# Altium schematic sheet CONNECTOR_A.SchDoc: =project_title
size Tabloid; CompanyName: Luxonis Holding; Organization: Luxonis Holding; Address1: 1925 Harmony Park Drive; Address2: Westminster, CO; Address3: 80234; Address4: United States; SheetNumber: 5; SheetTotal: 14
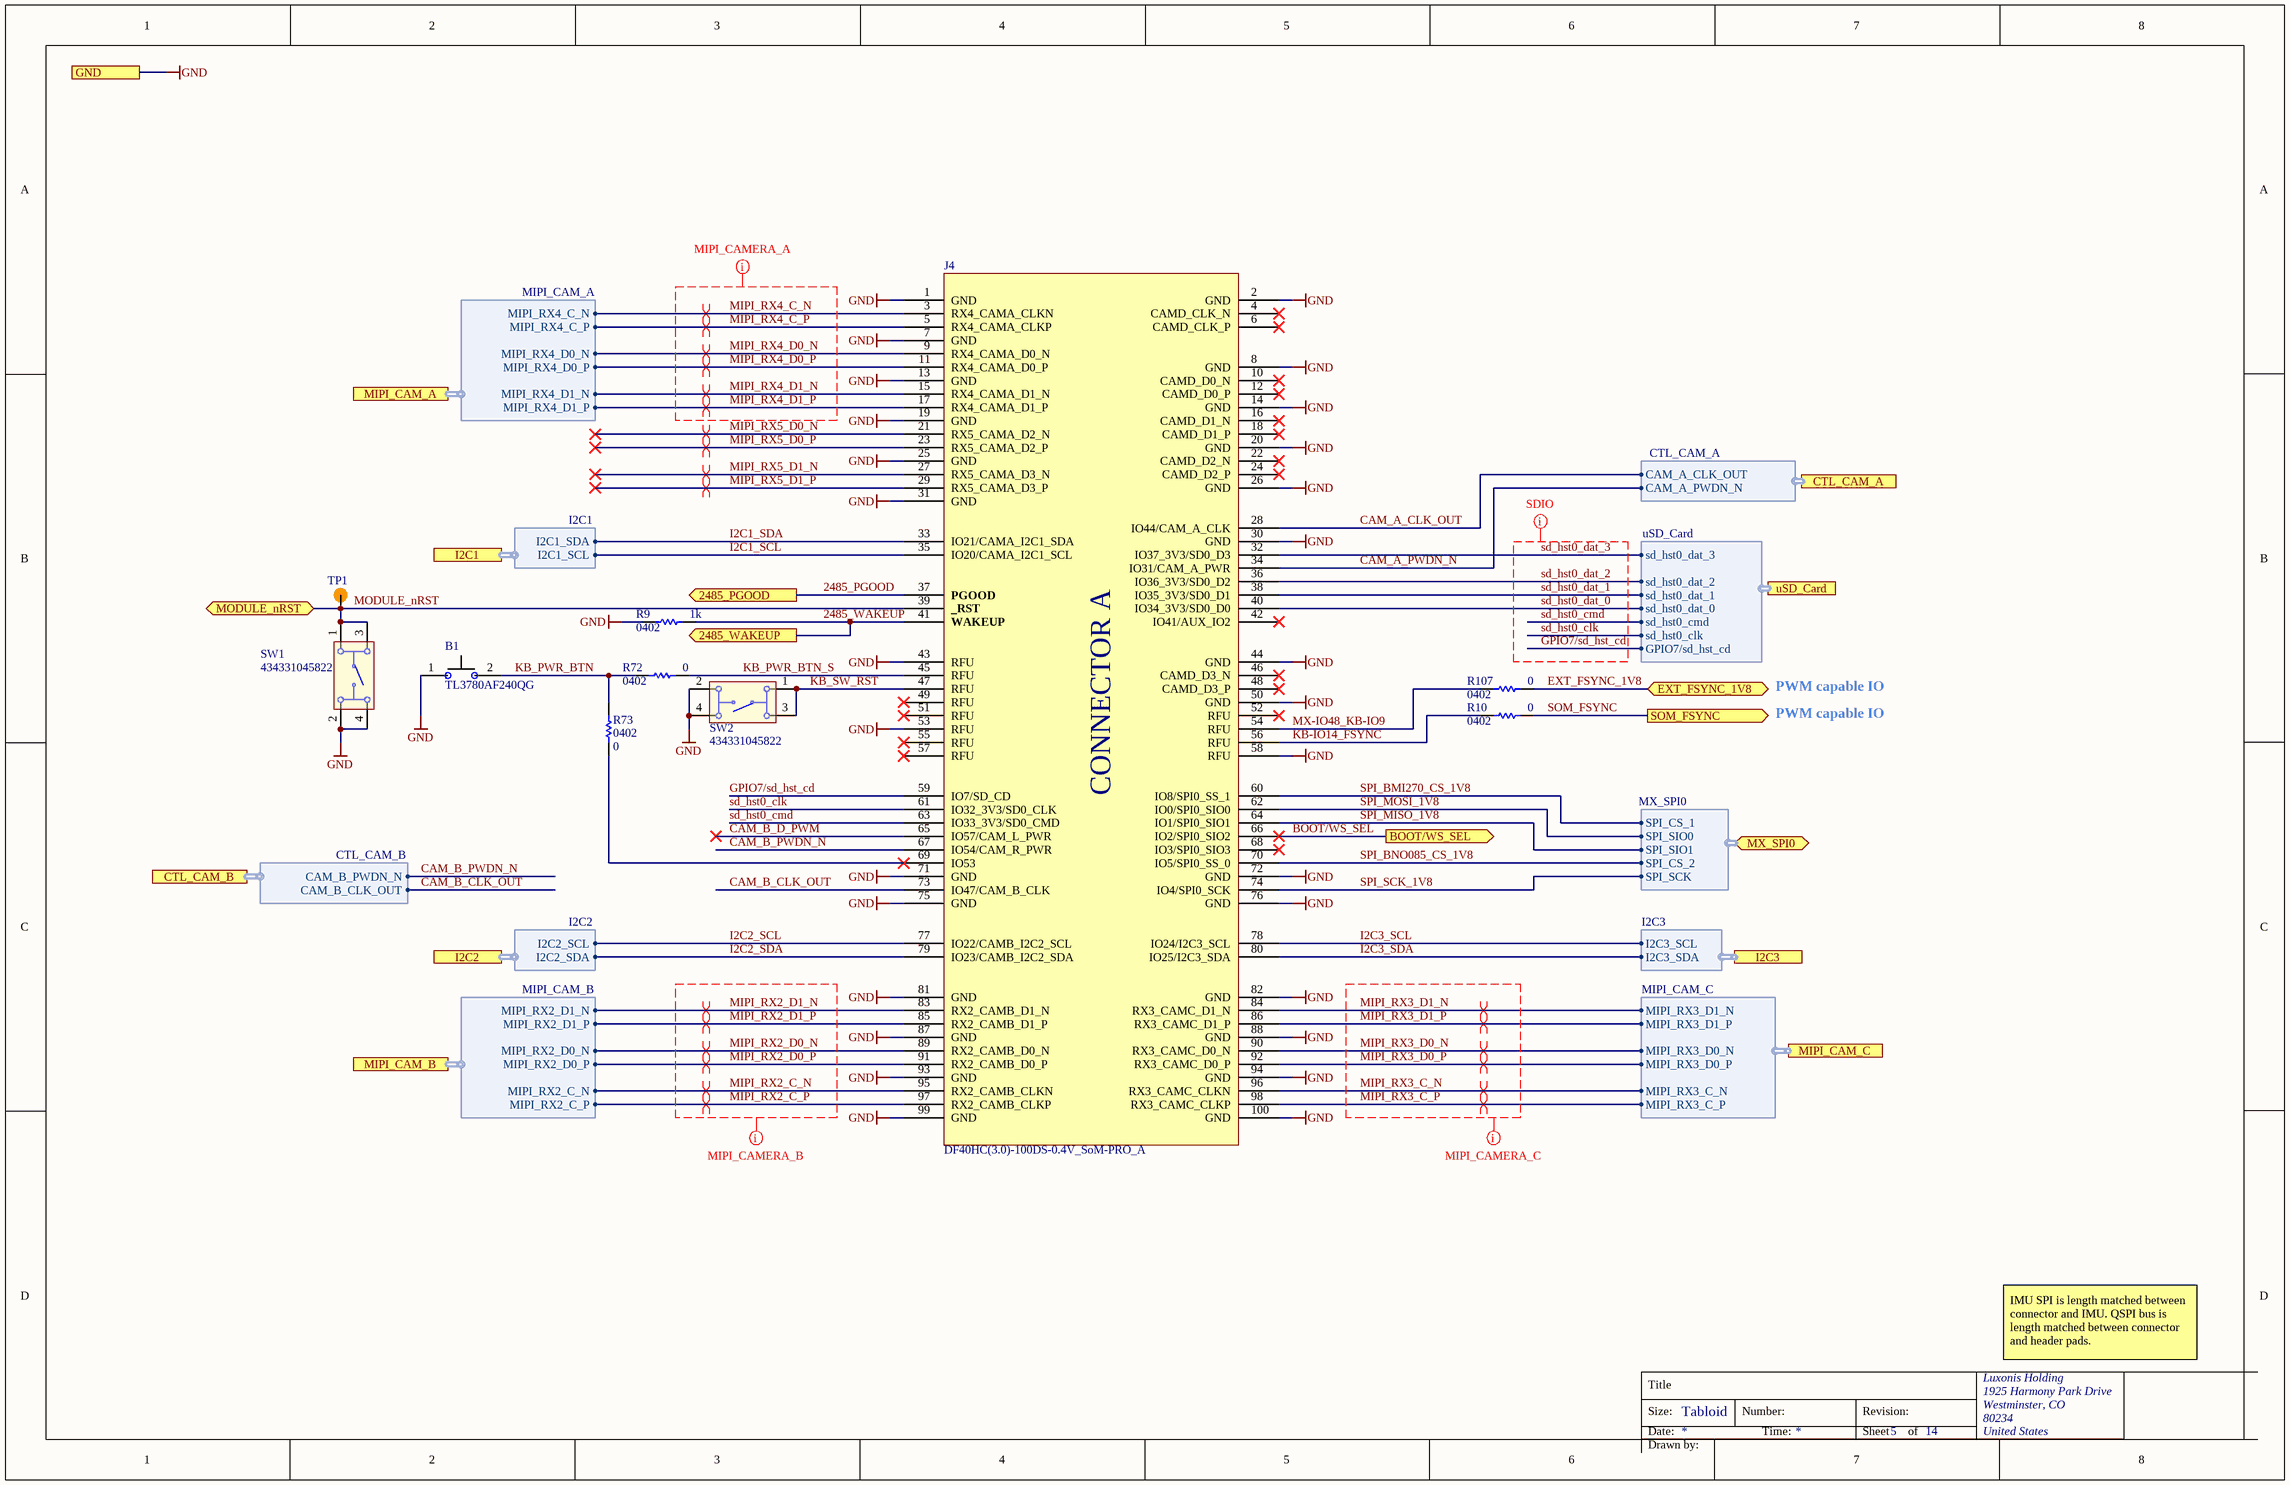
[diagram p0: CONNECTOR_A.SchDoc]

## Parts
B1  TL3780AF240QG  [TL3780AF240QG-Footprint-1]
J4  DF40HC(3.0)-100DS-0.4V_SoM-PRO_A  [CON_A_BW2099_SoM_DF40HC-3.0-100DS-0.4V_minpad]
R9  value 1k  Case/Package: 0402  [RESC0402(1005)_L]  (hidden comment: RC0402FR-071KL)
R10  value 0  Case/Package: 0402  [RESC0402(1005)_L]  (hidden comment: CRCW04020000Z0ED)
R72  value 0  Case/Package: 0402  [RESC0402(1005)_L]  (hidden comment: CRCW04020000Z0ED)
R73  value 0  Case/Package: 0402  [RESC0402(1005)_L]  (hidden comment: CRCW04020000Z0ED)
R107  value 0  Case/Package: 0402  [RESC0402(1005)_L]  (hidden comment: CRCW04020000Z0ED)
SW1  434331045822  [434331045822]
SW2  434331045822  [434331045822]
TP1  TP075_150_NS  [TP075_150_NS]  (value not drawn)  (no BOM)

## Ports
2485_PGOOD (out), 2485_WAKEUP (out), BOOT/WS_SEL (out), CTL_CAM_A (harness CTL_CAM_A), CTL_CAM_B (harness CTL_CAM_B), EXT_FSYNC_1V8 (bidir), GND, I2C1 (harness I2C1), I2C2 (harness I2C2), I2C3 (harness I2C3), MIPI_CAM_A (harness MIPI_CAM_A), MIPI_CAM_B (harness MIPI_CAM_B), MIPI_CAM_C (harness MIPI_CAM_C), MODULE_nRST (bidir), MX_SPI0 (bidir, harness MX_SPI0), SOM_FSYNC (out), uSD_Card (harness uSD_Card)

## Harnesses
MIPI_CAM_B: MIPI_RX2_C_P, MIPI_RX2_C_N, MIPI_RX2_D0_P, MIPI_RX2_D0_N, MIPI_RX2_D1_P, MIPI_RX2_D1_N
MIPI_CAM_A: MIPI_RX4_C_N, MIPI_RX4_C_P, MIPI_RX4_D0_N, MIPI_RX4_D0_P, MIPI_RX4_D1_N, MIPI_RX4_D1_P
MIPI_CAM_C: MIPI_RX3_C_P, MIPI_RX3_C_N, MIPI_RX3_D0_P, MIPI_RX3_D0_N, MIPI_RX3_D1_P, MIPI_RX3_D1_N
I2C2: I2C2_SDA, I2C2_SCL
I2C1: I2C1_SDA, I2C1_SCL
I2C3: I2C3_SDA, I2C3_SCL
MX_SPI0: SPI_SIO0, SPI_SIO1, SPI_CS_1, SPI_SCK, SPI_CS_2
CTL_CAM_A: CAM_A_PWDN_N, CAM_A_CLK_OUT
uSD_Card: sd_hst0_clk, sd_hst0_cmd, sd_hst0_dat_0, sd_hst0_dat_1, sd_hst0_dat_2, sd_hst0_dat_3, GPIO7/sd_hst_cd
CTL_CAM_B: CAM_B_PWDN_N, CAM_B_CLK_OUT

## Nets
GND: B1.1 J4.1(GND) J4.2(GND) J4.7(GND) J4.8(GND) J4.13(GND) J4.14(GND) J4.19(GND) J4.20(GND) J4.25(GND) J4.26(GND) J4.30(GND) J4.31(GND) J4.43(RFU) J4.44(GND) J4.50(GND) J4.53(RFU) J4.58(RFU) J4.71(GND) J4.72(GND) J4.75(GND) J4.76(GND) J4.81(GND) J4.82(GND) J4.87(GND) J4.88(GND) J4.93(GND) J4.94(GND) J4.99(GND) J4.100(GND) R9.2 SW1.2 SW1.4 SW2.2 SW2.4 ; port GND
2485_PGOOD: J4.37(PGOOD) ; port 2485_PGOOD
2485_WAKEUP: J4.41(WAKEUP) R9.1 ; port 2485_WAKEUP
BOOT/WS_SEL: J4.66(IO2/SPI0_SIO2) ; port BOOT/WS_SEL
CAM_A_CLK_OUT: J4.28(IO44/CAM_A_CLK) ; port CTL_CAM_A.CAM_A_CLK_OUT
CAM_A_PWDN_N: J4.34(IO31/CAM_A_PWR) ; port CTL_CAM_A.CAM_A_PWDN_N
CAM_B_CLK_OUT: J4.73(IO47/CAM_B_CLK) ; port CTL_CAM_B.CAM_B_CLK_OUT
CAM_B_D_PWM: J4.65(IO57/CAM_L_PWR)
CAM_B_PWDN_N: J4.67(IO54/CAM_R_PWR) ; port CTL_CAM_B.CAM_B_PWDN_N
EXT_FSYNC_1V8: R107.2 ; port EXT_FSYNC_1V8
GPIO7/sd_hst_cd: J4.59(IO7/SD_CD) ; port uSD_Card.GPIO7/sd_hst_cd
I2C1_SCL: J4.35(IO20/CAMA_I2C1_SCL) ; port I2C1.I2C1_SCL
I2C1_SDA: J4.33(IO21/CAMA_I2C1_SDA) ; port I2C1.I2C1_SDA
I2C2_SCL: J4.77(IO22/CAMB_I2C2_SCL) ; port I2C2.I2C2_SCL
I2C2_SDA: J4.79(IO23/CAMB_I2C2_SDA) ; port I2C2.I2C2_SDA
I2C3_SCL: J4.78(IO24/I2C3_SCL) ; port I2C3.I2C3_SCL
I2C3_SDA: J4.80(IO25/I2C3_SDA) ; port I2C3.I2C3_SDA
KB-IO14_FSYNC: J4.56(RFU) R10.1
KB_PWR_BTN: B1.2 R72.1 R73.2
KB_PWR_BTN_S: J4.45(RFU) R72.2
KB_SW_RST: J4.47(RFU) SW2.1 SW2.3
MIPI_RX2_C_N: J4.95(RX2_CAMB_CLKN) ; port MIPI_CAM_B.MIPI_RX2_C_N
MIPI_RX2_C_P: J4.97(RX2_CAMB_CLKP) ; port MIPI_CAM_B.MIPI_RX2_C_P
MIPI_RX2_D0_N: J4.89(RX2_CAMB_D0_N) ; port MIPI_CAM_B.MIPI_RX2_D0_N
MIPI_RX2_D0_P: J4.91(RX2_CAMB_D0_P) ; port MIPI_CAM_B.MIPI_RX2_D0_P
MIPI_RX2_D1_N: J4.83(RX2_CAMB_D1_N) ; port MIPI_CAM_B.MIPI_RX2_D1_N
MIPI_RX2_D1_P: J4.85(RX2_CAMB_D1_P) ; port MIPI_CAM_B.MIPI_RX2_D1_P
MIPI_RX3_C_N: J4.96(RX3_CAMC_CLKN) ; port MIPI_CAM_C.MIPI_RX3_C_N
MIPI_RX3_C_P: J4.98(RX3_CAMC_CLKP) ; port MIPI_CAM_C.MIPI_RX3_C_P
MIPI_RX3_D0_N: J4.90(RX3_CAMC_D0_N) ; port MIPI_CAM_C.MIPI_RX3_D0_N
MIPI_RX3_D0_P: J4.92(RX3_CAMC_D0_P) ; port MIPI_CAM_C.MIPI_RX3_D0_P
MIPI_RX3_D1_N: J4.84(RX3_CAMC_D1_N) ; port MIPI_CAM_C.MIPI_RX3_D1_N
MIPI_RX3_D1_P: J4.86(RX3_CAMC_D1_P) ; port MIPI_CAM_C.MIPI_RX3_D1_P
MIPI_RX4_C_N: J4.3(RX4_CAMA_CLKN) ; port MIPI_CAM_A.MIPI_RX4_C_N
MIPI_RX4_C_P: J4.5(RX4_CAMA_CLKP) ; port MIPI_CAM_A.MIPI_RX4_C_P
MIPI_RX4_D0_N: J4.9(RX4_CAMA_D0_N) ; port MIPI_CAM_A.MIPI_RX4_D0_N
MIPI_RX4_D0_P: J4.11(RX4_CAMA_D0_P) ; port MIPI_CAM_A.MIPI_RX4_D0_P
MIPI_RX4_D1_N: J4.15(RX4_CAMA_D1_N) ; port MIPI_CAM_A.MIPI_RX4_D1_N
MIPI_RX4_D1_P: J4.17(RX4_CAMA_D1_P) ; port MIPI_CAM_A.MIPI_RX4_D1_P
MIPI_RX5_D0_N: J4.21(RX5_CAMA_D2_N)
MIPI_RX5_D0_P: J4.23(RX5_CAMA_D2_P)
MIPI_RX5_D1_N: J4.27(RX5_CAMA_D3_N)
MIPI_RX5_D1_P: J4.29(RX5_CAMA_D3_P)
MODULE_nRST: J4.39(_RST) SW1.1 SW1.3 TP1.1 ; port MODULE_nRST
MX-IO48_KB-IO9: J4.54(RFU) R107.1
sd_hst0_clk: J4.61(IO32_3V3/SD0_CLK) ; port uSD_Card.sd_hst0_clk
sd_hst0_cmd: J4.63(IO33_3V3/SD0_CMD) ; port uSD_Card.sd_hst0_cmd
sd_hst0_dat_0: J4.40(IO34_3V3/SD0_D0) ; port uSD_Card.sd_hst0_dat_0
sd_hst0_dat_1: J4.38(IO35_3V3/SD0_D1) ; port uSD_Card.sd_hst0_dat_1
sd_hst0_dat_2: J4.36(IO36_3V3/SD0_D2) ; port uSD_Card.sd_hst0_dat_2
sd_hst0_dat_3: J4.32(IO37_3V3/SD0_D3) ; port uSD_Card.sd_hst0_dat_3
SOM_FSYNC: R10.2 ; port SOM_FSYNC
SPI_BMI270_CS_1V8: J4.60(IO8/SPI0_SS_1) ; port MX_SPI0.SPI_CS_1
SPI_BNO085_CS_1V8: J4.70(IO5/SPI0_SS_0) ; port MX_SPI0.SPI_CS_2
SPI_MISO_1V8: J4.64(IO1/SPI0_SIO1) ; port MX_SPI0.SPI_SIO1
SPI_MOSI_1V8: J4.62(IO0/SPI0_SIO0) ; port MX_SPI0.SPI_SIO0
SPI_SCK_1V8: J4.74(IO4/SPI0_SCK) ; port MX_SPI0.SPI_SCK
NetJ4_69: J4.69(IO53) R73.1

Not connected (* = marked no-connect by the designer): J4 4(CAMD_CLK_N)* 6(CAMD_CLK_P)* 10(CAMD_D0_N)* 12(CAMD_D0_P)* 16(CAMD_D1_N)* 18(CAMD_D1_P)* 22(CAMD_D2_N)* 24(CAMD_D2_P)* 42(IO41/AUX_IO2)* 46(CAMD_D3_N)* 48(CAMD_D3_P)* 49(RFU)* 51(RFU)* 52(RFU)* 55(RFU)* 57(RFU)* 68(IO3/SPI0_SIO3)*

## Layout directives
net class MIPI_CAM_A: MIPI_RX4_C_N, MIPI_RX4_C_P, MIPI_RX4_D0_N, MIPI_RX4_D0_P, MIPI_RX4_D1_N, MIPI_RX4_D1_P
net class MIPI_CAM_C: MIPI_RX3_C_N, MIPI_RX3_C_P, MIPI_RX3_D0_N, MIPI_RX3_D0_P, MIPI_RX3_D1_N, MIPI_RX3_D1_P
net class MIPI_CAM_B: MIPI_RX2_C_N, MIPI_RX2_C_P, MIPI_RX2_D0_N, MIPI_RX2_D0_P, MIPI_RX2_D1_N, MIPI_RX2_D1_P
net class SDIO: GPIO7/sd_hst_cd, sd_hst0_clk, sd_hst0_cmd, sd_hst0_dat_0, sd_hst0_dat_1, sd_hst0_dat_2, sd_hst0_dat_3
differential pair; net class MIPI; differential pair class 100ohm: MIPI_RX2_C_N, MIPI_RX2_C_P, MIPI_RX2_D0_N, MIPI_RX2_D0_P, MIPI_RX2_D1_N, MIPI_RX2_D1_P, MIPI_RX3_C_N, MIPI_RX3_C_P, MIPI_RX3_D0_N, MIPI_RX3_D0_P, MIPI_RX3_D1_N, MIPI_RX3_D1_P, MIPI_RX4_C_N, MIPI_RX4_C_P, MIPI_RX4_D0_N, MIPI_RX4_D0_P, MIPI_RX4_D1_N, MIPI_RX4_D1_P, MIPI_RX5_D0_N, MIPI_RX5_D0_P, MIPI_RX5_D1_N, MIPI_RX5_D1_P

## Notes on the sheet
- PWM capable IO
- IMU SPI is length matched between connector and IMU. QSPI bus is length matched between connector and header pads.
- Title
- Size:
- Date:
- Tabloid
- Number:
- Time:
- Revision:
- Sheet
- of
- Drawn by:
- (in symbol CMP-005-000052-4) CONNECTOR A

## Library data of the parts
B1 = CMP-011-00023-1: Keypad Switch, 1 Switches, SPST, Momentary-tactile, 0.05A, 12VDC, 2.35N, Solder Terminal, Surface Mount-straight; Manufacturer 1: E-Switch; Manufacturer Part Number 1: TL3780AF240QG
J4 = CMP-005-000052-4: OAK-SoM-Pro base board conn. A; Manufacturer Part Number 1: DF40HC(3.0)-100DS-0.4V(58); Manufacturer 1: Hirose; Pitch: 0.016inch; Number of Positions: 100; System: Connector; Connector Type: Receptacle; Contact Plating: Gold; Pricing 1: 1=2.54000, 10=2.26000, 25=2.07000, 50=2.07000, 100=1.98000, 250=1.79000, 500=1.65000, 1000=1.41000, 3000=1.32000, 6000=1.23000, 10000=1.23000 (USD); Pricing 2: 1=2.50000, 10=2.40000, 25=2.10000, 50=2.10000, 100=2.00000, 250=1.76000, 500=1.71000, 1000=1.45000, 2000=1.36000, 5000=1.31000, 10000=1.31000 (USD); ComponentLink2URL: https://datasheet.ciiva.com/18562/ed-df40-20140305-18562189.pdf?src-supplier=Digi-Key; ComponentLink3URL: https://datasheet.ciiva.com/13559/ed-df40-20140305-13559540.pdf?src-supplier=Mouser; ComponentLink4URL: https://datasheet.ciiva.com/18562/ed-df40-20140305-18562462.pdf?src-supplier=Digi-Key; Number of Rows: 2; Mount: Surface Mount; Packaging: Tape and Reel; Package Quantity: 1000; Design Item ID: DF40HC(3.0)-100DS-0.4V_SoM-PRO_A; ComponentLink1URL: https://datasheet.ciiva.com/46636/ed-df40-20140305-46636517.pdf?src-supplier=Digi-Key; ComponentLink2Description: https://datasheet.ciiva.com/18562/ed-df40-20140305-18562189.pdf?src-supplier=Digi-Key; RoHS: Yes; Source: LuxonisMaster.SchLib; Lead Free: Lead Free; Stock 1: 2172; Stock 2: 2078; ComponentLink3Description: https://datasheet.ciiva.com/13559/ed-df40-20140305-13559540.pdf?src-supplier=Mouser; ComponentLink1Description: https://datasheet.ciiva.com/46636/ed-df40-20140305-46636517.pdf?src-supplier=Digi-Key; ComponentLink4Description: https://datasheet.ciiva.com/18562/ed-df40-20140305-18562462.pdf?src-supplier=Digi-Key; Pins: 100
R9 = CMP-013-000004-10: RES SMD 1K OHM 1% 1/16W 0402; Manufacturer 1: Yageo; Power Rating: 62.5mW; Voltage Rating: 50V; Min Operating Temperature: -55°C; Design Item ID: RC0402FR-071KL; Tolerance: 1%; Max Operating Temperature: 155°C; Manufacturer Part Number 1: RC0402FR-071KL
R10 R72 R73 R107 = CMP-013-000022-11: RES SMD 0 OHM 5% 1/16W 0402; Manufacturer 1: Vishay; Voltage Rating: 50V; Power Rating: 63mW; Max Operating Temperature: 155°C; Manufacturer Part Number 1: CRCW04020000Z0ED; Tolerance: 5%; Min Operating Temperature: -55°C; Design Item ID: CRCW04020000Z0ED
SW1 SW2 = CMP-011-00016-3: Keypad Switch, 1 Switches, SPST, Momentary-tactile, 0.05A, 12VDC, 2.65N, Solder Terminal, Surface Mount-right Angle; Manufacturer 1: Wurth Electronics; Voltage Rating: 12V; Max Current Rating: 50mA; Throw Configuration: SPST-NO; Supplier Part Number 1: 732-7055-2-ND; Manufacturer part number 1: 434331045822; Pins: 4; Supplier 1: Digi-Key; Current Rating: 50mA; Mounting Technology: SMD; Case/Package: 434331045822
TP1 = TEST_POINT